# Altium schematic sheet Sheet1.SchDoc
size A4
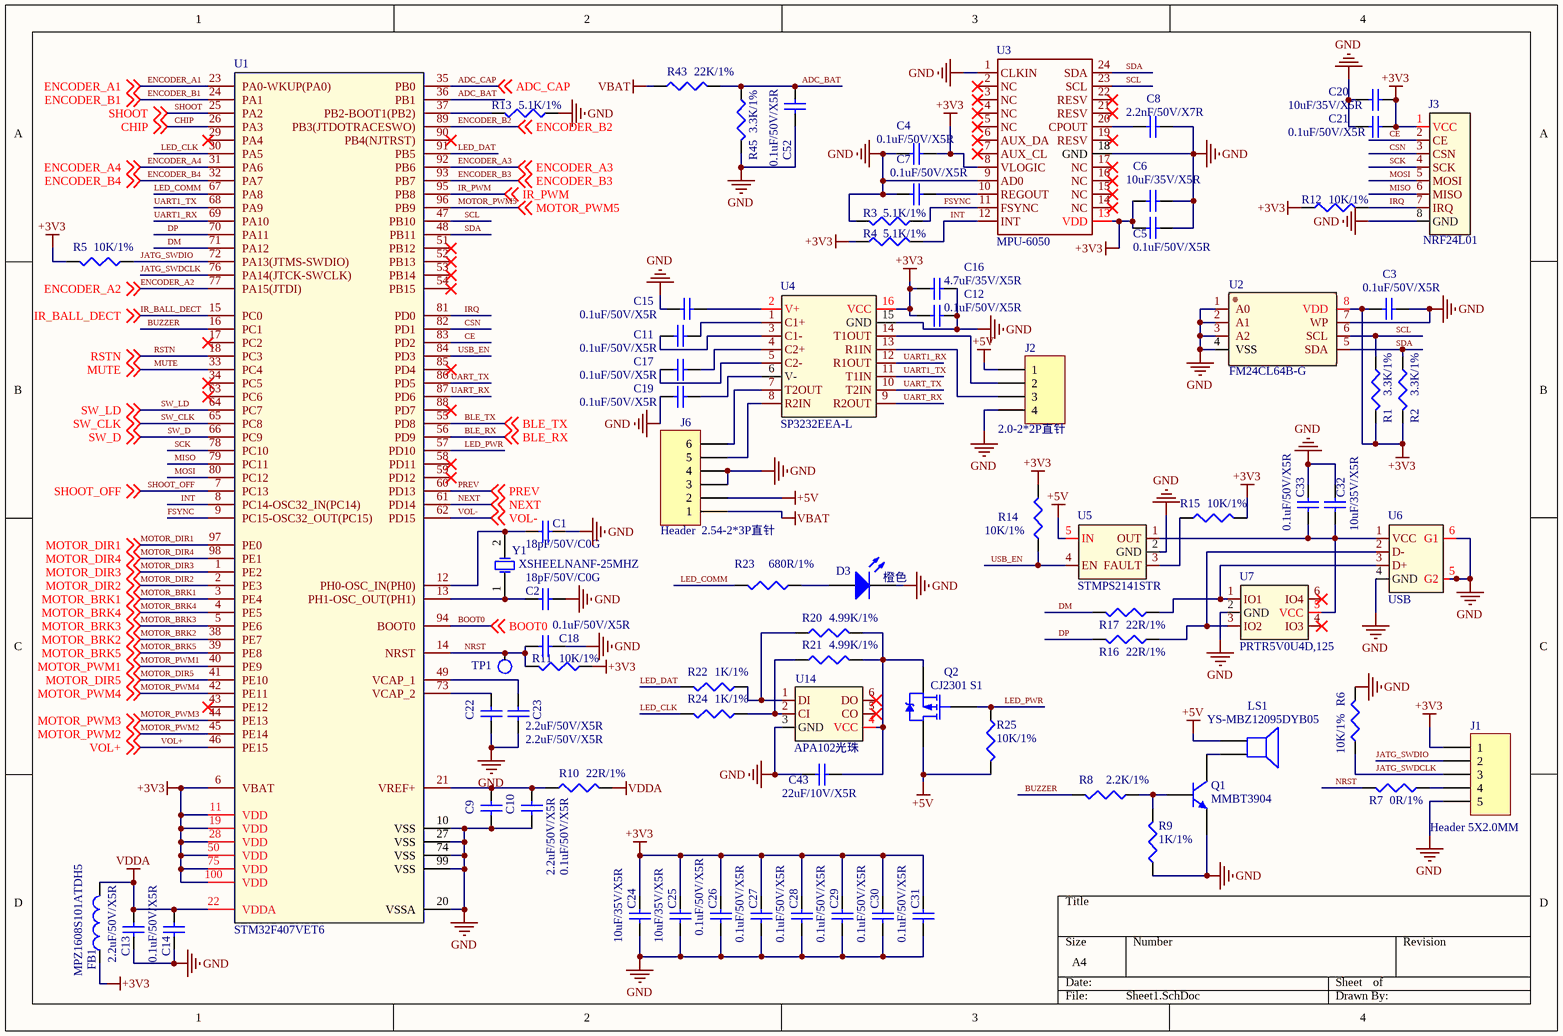
[diagram p0: Sheet1.SchDoc]

## Parts
C1  18pF/50V/C0G  [C0603]
C2  18pF/50V/C0G  [C0603]
C3  0.1uF/50V/X5R  [C0603]
C4  0.1uF/50V/X5R  [C0603]
C5  0.1uF/50V/X5R  [C0603]
C6  10uF/35V/X5R  [C0805]
C7  0.1uF/50V/X5R  [C0603]
C8  2.2nF/50V/X7R  [C0603]
C9  2.2uF/50V/X5R  [C0603]
C10  0.1uF/50V/X5R  [C0603]
C11  0.1uF/50V/X5R  [C0603]
C12  0.1uF/50V/X5R  [C0603]
C13  2.2uF/50V/X5R  [C0603]
C14  0.1uF/50V/X5R  [C0603]
C15  0.1uF/50V/X5R  [C0603]
C16  4.7uF/35V/X5R  [C0603]
C17  0.1uF/50V/X5R  [C0603]
C18  0.1uF/50V/X5R  [C0603]
C19  0.1uF/50V/X5R  [C0603]
C20  10uF/35V/X5R  [C0805]
C21  0.1uF/50V/X5R  [C0603]
C22  2.2uF/50V/X5R  [C0603]
C23  2.2uF/50V/X5R  [C0603]
C24  10uF/35V/X5R  [C0805]
C25  10uF/35V/X5R  [C0805]
C26  0.1uF/50V/X5R  [C0603]
C27  0.1uF/50V/X5R  [C0603]
C28  0.1uF/50V/X5R  [C0603]
C29  0.1uF/50V/X5R  [C0603]
C30  0.1uF/50V/X5R  [C0603]
C31  0.1uF/50V/X5R  [C0603]
C32  10uF/35V/X5R  [C0805]
C33  0.1uF/50V/X5R  [C0603]
C43  22uF/10V/X5R  [C0805]
C52  0.1uF/50V/X5R  [C0603]
D3  橙色  [LED0603]
FB1  MPZ1608S101ATDH5  [R0603]
J1  Header 5X2.0MM  [DIP-1X5_2.0MM]
J2  2.0-2*2P直针  [DIP_2X2_2MM]
J3  NRF24L01  [WIFI]
J6  Header  2.54-2*3P直针  [DIP_2X3_2.54]
LS1  YS-MBZ12095DYB05  [DIP-P7.6]
Q1  MMBT3904  [SOT-23]
Q2  CJ2301 S1  [SOT-23]
R1  3.3K/1%  [R0603]
R2  3.3K/1%  [R0603]
R3  5.1K/1%  [R0603]
R4  5.1K/1%  [R0603]
R5  10K/1%  [R0603]
R6  10K/1%  [R0603]
R7  0R/1%  [R0603]
R8  2.2K/1%  [R0603]
R9  1K/1%  [R0603]
R10  22R/1%  [R0603]
R11  10K/1%  [R0603]
R12  10K/1%  [R0603]
R13  5.1K/1%  [R0603]
R14  10K/1%  [R0603]
R15  10K/1%  [R0603]
R16  22R/1%  [R0603]
R17  22R/1%  [R0603]
R20  4.99K/1%  [R0603]
R21  4.99K/1%  [R0603]
R22  1K/1%  [R0603]
R23  680R/1%  [R0603]
R24  1K/1%  [R0603]
R25  10K/1%  [R0603]
R43  22K/1%  [R0603]
R45  3.3K/1%  [R0603]
TP1  TP  [TP]  (value not drawn)
U1  STM32F407VET6  [LQFP-100-14X]
U2  FM24CL64B-G  [SOIC-8]
U3  MPU-6050  [QFN-24]
U4  SP3232EEA-L  [SSOP-16]
U5  STMPS2141STR  [SOT-23-5]
U6  USB  [USB2.0]
U7  PRTR5V0U4D,125  [SOT-23-6]
U14  APA102光珠  [LED-5X5]
Y1  XSHEELNANF-25MHZ  [SMD_5032]

## Nets
+3V3: C3.1 C4.1 C5.1 C6.1 C12.2 C16.2 C20.1 C21.1 C24.2 C25.1 C26.1 C27.2 C28.2 C29.2 C30.1 C31.1 FB1.2 J1.1 J3.1(VCC) R1.2 R2.2 R4.1 R5.2 R11.1 R12.1 R14.2 R15.2 U1.6(VBAT) U1.11(VDD) U1.19(VDD) U1.28(VDD) U1.50(VDD) U1.75(VDD) U1.100(VDD) U2.8(VDD) U3.8(VLOGIC) U3.13(VDD) U4.16(VCC)
+5V: J2.1 J6.2 LS1.1 Q2.2(D) R25.2 U5.5(IN)
GND: C1.2 C2.2 C3.2 C4.2 C5.2 C6.2 C7.2 C8.2 C9.2 C10.2 C12.1 C13.1 C14.1 C15.2 C16.1 C18.1 C19.2 C20.2 C21.2 C22.2 C23.2 C24.1 C25.2 C26.2 C27.1 C28.1 C29.1 C30.2 C31.2 C32.2 C33.2 C43.1 C52.2 D3.2(K) J1.5 J2.4 J3.8(GND) J6.3 J6.4 Q1.2(E) R3.2 R6.2 R9.1 R13.1 R45.2 U1.10(VSS) U1.20(VSSA) U1.27(VSS) U1.74(VSS) U1.99(VSS) U2.1(A0) U2.2(A1) U2.3(A2) U2.4(VSS) U2.7(WP) U3.1(CLKIN) U3.9(AD0) U3.18(GND) U4.15(GND) U5.2(GND) U6.4(GND) U6.5(G2) U6.6(G1) U7.2(GND) U14.3(GND)
VBAT: J6.1 R43.1
VDDA: C13.2 C14.2 FB1.1 R10.2 U1.22(VDDA)
ADC_BAT: C52.1 R43.2 R45.1 U1.36(PB1)
ADC_CAP: U1.35(PB0) ; off-sheet ADC_CAP
BLE_RX: U1.56(PD9) ; off-sheet BLE_RX
BLE_TX: U1.55(PD8) ; off-sheet BLE_TX
BOOT0: U1.94(BOOT0) ; off-sheet BOOT0
BUZZER: R8.2 U1.16(PC1)
CE: J3.2(CE) U1.83(PD2)
CHIP: U1.26(PA3) ; off-sheet CHIP
CSN: J3.3(CSN) U1.82(PD1)
DM: R17.2 U1.71(PA12)
DP: R16.2 U1.70(PA11)
ENCODER_A1: U1.23(PA0-WKUP(PA0)) ; off-sheet ENCODER_A1
ENCODER_A2: U1.77(PA15(JTDI)) ; off-sheet ENCODER_A2
ENCODER_A3: U1.92(PB6) ; off-sheet ENCODER_A3
ENCODER_A4: U1.31(PA6) ; off-sheet ENCODER_A4
ENCODER_B1: U1.24(PA1) ; off-sheet ENCODER_B1
ENCODER_B2: U1.89(PB3(JTDOTRACESWO)) ; off-sheet ENCODER_B2
ENCODER_B3: U1.93(PB7) ; off-sheet ENCODER_B3
ENCODER_B4: U1.32(PA7) ; off-sheet ENCODER_B4
FSYNC: R3.1 U1.9(PC15-OSC32_OUT(PC15)) U3.11(FSYNC)
INT: R4.2 U1.8(PC14-OSC32_IN(PC14)) U3.12(INT)
IR_BALL_DECT: U1.15(PC0) ; off-sheet IR_BALL_DECT
IR_PWM: U1.95(PB8) ; off-sheet IR_PWM
IRQ: J3.7(IRQ) R12.2 U1.81(PD0)
JATG_SWDCLK: J1.3 R6.1 U1.76(PA14(JTCK-SWCLK))
JATG_SWDIO: J1.2 R5.1 U1.72(PA13(JTMS-SWDIO))
LED_CLK: R24.2 U1.30(PA5)
LED_COMM: R23.2 U1.67(PA8)
LED_DAT: R22.2 U1.91(PB5)
LED_PWR: Q2.1(G) R25.1 U1.57(PD10)
MISO: J3.6(MISO) U1.79(PC11)
MOSI: J3.5(MOSI) U1.80(PC12)
MOTOR_BRK1: U1.3(PE4) ; off-sheet MOTOR_BRK1
MOTOR_BRK2: U1.38(PE7) ; off-sheet MOTOR_BRK2
MOTOR_BRK3: U1.5(PE6) ; off-sheet MOTOR_BRK3
MOTOR_BRK4: U1.4(PE5) ; off-sheet MOTOR_BRK4
MOTOR_BRK5: U1.39(PE8) ; off-sheet MOTOR_BRK5
MOTOR_DIR1: U1.97(PE0) ; off-sheet MOTOR_DIR1
MOTOR_DIR2: U1.2(PE3) ; off-sheet MOTOR_DIR2
MOTOR_DIR3: U1.1(PE2) ; off-sheet MOTOR_DIR3
MOTOR_DIR4: U1.98(PE1) ; off-sheet MOTOR_DIR4
MOTOR_DIR5: U1.41(PE10) ; off-sheet MOTOR_DIR5
MOTOR_PWM1: U1.40(PE9) ; off-sheet MOTOR_PWM1
MOTOR_PWM2: U1.45(PE14) ; off-sheet MOTOR_PWM2
MOTOR_PWM3: U1.44(PE13) ; off-sheet MOTOR_PWM3
MOTOR_PWM4: U1.42(PE11) ; off-sheet MOTOR_PWM4
MOTOR_PWM5: U1.96(PB9) ; off-sheet MOTOR_PWM5
MUTE: U1.33(PC4) ; off-sheet MUTE
NEXT: U1.61(PD14) ; off-sheet NEXT
NRST: C18.2 R7.2 R11.2 TP1.1 U1.14(NRST)
PREV: U1.60(PD13) ; off-sheet PREV
RSTN: U1.18(PC3) ; off-sheet RSTN
SCK: J3.4(SCK) U1.78(PC10)
SCL: R1.1 U1.47(PB10) U2.6(SCL) U3.23(SCL)
SDA: R2.1 U1.48(PB11) U2.5(SDA) U3.24(SDA)
SHOOT: U1.25(PA2) ; off-sheet SHOOT
SHOOT_OFF: U1.7(PC13) ; off-sheet SHOOT_OFF
SW_CLK: U1.65(PC8) ; off-sheet SW_CLK
SW_D: U1.66(PC9) ; off-sheet SW_D
SW_LD: U1.64(PC7) ; off-sheet SW_LD
UART1_RX: U1.69(PA10) U4.12(R1OUT)
UART1_TX: U1.68(PA9) U4.11(T1IN)
UART_RX: U1.87(PD6) U4.9(R2OUT)
UART_TX: U1.86(PD5) U4.10(T2IN)
USB_EN: R14.1 U1.84(PD3) U5.4(EN)
VOL+: U1.46(PE15) ; off-sheet VOL+
VOL-: U1.62(PD15) ; off-sheet VOL-
NetC1_1: C1.1 U1.12(PH0-OSC_IN(PH0)) Y1.2(OSC2)
NetC2_1: C2.1 U1.13(PH1-OSC_OUT(PH1)) Y1.1(OSC1)
NetC7_1: C7.1 U3.10(REGOUT)
NetC8_1: C8.1 U3.20(CPOUT)
NetC9_1: C9.1 C10.1 R10.1 U1.21(VREF+)
NetC11_1: C11.1 U4.1(C1+)
NetC11_2: C11.2 U4.3(C1-)
NetC15_1: C15.1 U4.2(V+)
NetC17_1: C17.1 U4.4(C2+)
NetC17_2: C17.2 U4.5(C2-)
NetC19_1: C19.1 U4.6(V-)
NetC22_1: C22.1 U1.73(VCAP_2)
NetC23_1: C23.1 U1.49(VCAP_1)
NetC32_1: C32.1 C33.1 U5.1(OUT) U6.1(VCC) U7.5(VCC)
NetC43_2: C43.2 Q2.3(S) R20.2 R21.2 U14.4(VCC)
NetD3_1: D3.1(A) R23.1
NetJ1_4: J1.4 R7.1
NetJ2_2: J2.2 U4.14(T1OUT)
NetJ2_3: J2.3 U4.13(R1IN)
NetJ6_5: J6.5 U4.8(R2IN)
NetJ6_6: J6.6 U4.7(T2OUT)
NetLS1_2: LS1.2 Q1.3(C)
NetQ1_1: Q1.1(B) R8.1 R9.2
NetR13_2: R13.2 U1.37(PB2-BOOT1(PB2))
NetR15_1: R15.1 U5.3(FAULT)
NetR16_1: R16.1 U6.2(D-) U7.3(IO2)
NetR17_1: R17.1 U6.3(D+) U7.1(IO1)
NetR20_1: R20.1 R22.1 U14.1(DI)
NetR21_1: R21.1 R24.1 U14.2(CI)

Not connected (* = marked no-connect by the designer): U1 17(PC2)* 29(PA4)* 34(PC5)* 43(PE12)* 51(PB12)* 52(PB13)* 53(PB14)* 54(PB15)* 58(PD11)* 59(PD12)* 63(PC6)* 85(PD4)* 88(PD7)* 90(PB4(NJTRST))*; U3 2(NC)* 3(NC)* 4(NC)* 5(NC)* 6(AUX_DA)* 7(AUX_CL)* 14(NC)* 15(NC)* 16(NC)* 17(NC)* 19(RESV)* 21(RESV)* 22(RESV)*; U7 4(IO3)* 6(IO4)*; U14 5(CO)* 6(DO)*

## Library data of the parts
C1-C33 C43 C52 = Cap Semi: Capacitor (Semiconductor SIM Model); Value: 100pF; Published: 8-Jun-2000; LatestRevisionDate: 29-May-2009; LatestRevisionNote: IPC-7351 Footprint Added.; PackageReference: C1206; Publisher: Altium Limited; PackageDescription: Chip Capacitor
D3 = LED2: Typical RED, GREEN, YELLOW, AMBER GaAs LED; Published: 8-Jun-2000; LatestRevisionDate: 17-Jul-2002; LatestRevisionNote: Re-released for DXP Platform.; PackageVersion: Feb-2002; PackageReference: 3.2X1.6X1.1; Publisher: Altium Limited; PackageDescription: SM LED; 2 Flat Leads
FB1 = Inductor: Code_IEC: 1005; Value: 10mH; Published: 8-Jun-2000; LatestRevisionDate: 29-May-2009; LatestRevisionNote: IPC-7351 Footprint Added.; PackageReference: 0402-A; Publisher: Altium Limited; PackageDescription: Chip Inductor; Code_JEITA: 0402
J1 = Header 5: Header, 5-Pin; LatestRevisionDate: 17-Jul-2002; LatestRevisionNote: Re-released for DXP Platform.; Publisher: Altium Limited
J2 = Header 4: Header, 4-Pin; LatestRevisionDate: 17-Jul-2002; LatestRevisionNote: Re-released for DXP Platform.; Publisher: Altium Limited
J6 = Header 6: Header, 6-Pin; LatestRevisionDate: 17-Jul-2002; LatestRevisionNote: Re-released for DXP Platform.; Publisher: Altium Limited
LS1 = Speaker: Loudspeaker; Published: 24-Mar-1999; LatestRevisionDate: 17-Jul-2002; LatestRevisionNote: Re-released for DXP Platform.; PackageReference: PIN2; Publisher: Altium Limited
Q2 = PMOS-2: P-Channel Power MOSFET; Note: Pin 4 not drawn and electrically connected to Pin 2.; Published: 8-Jun-2000; LatestRevisionDate: 17-Jul-2002; LatestRevisionNote: Re-released for DXP Platform.; DatasheetVersion: PD-9.390D; PackageVersion: Feb-1997; PackageReference: TO-220AB; Publisher: Altium Limited; PackageDescription: TO, Thru-Hole, Vertical, Heatsink Mounted; 3 In-Line Leads; Pitch 2.54 mm; ComponentLink1Description: Manufacturer Link; ComponentLink1URL: http://www.irf.com/
R1-R17 R20-R25 R43 R45 = Res3: Resistor; Value: 1K; Published: 8-Jun-2000; LatestRevisionDate: 29-May-2009; LatestRevisionNote: IPC-7351 Footprint Added.; PackageReference: J1-0603; Publisher: Altium Limited; PackageDescription: Chip Resistor
U14 = APA102
Y1 = XTAL: Crystal Oscillator; Published: 8-Jun-2000; LatestRevisionDate: 17-Jul-2002; LatestRevisionNote: Re-released for DXP Platform.; PackageReference: R38; Publisher: Altium Limited; PackageDescription: Crystal, Thru-Hole; 2 Leads; Body 3.1 x 8.2 mm (Dia.xH)